# Altium schematic sheet SCH_TOP.SchDoc
size A4
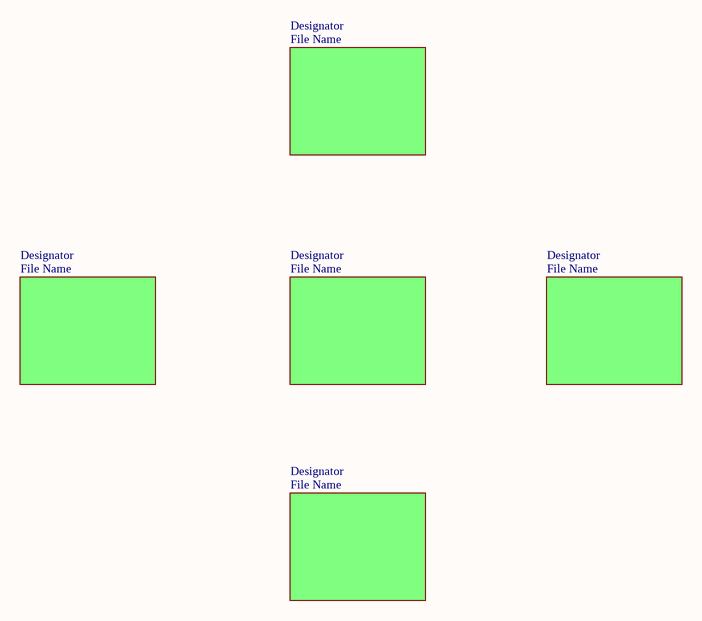
[diagram p0: SCH_TOP.SchDoc]

## Sub-sheets
Designator = File Name: no entries
Designator = File Name: no entries
Designator = File Name: no entries
Designator = File Name: no entries
Designator = File Name: no entries